# EAGLE design Main_backup (EAGLE 7.2.0)
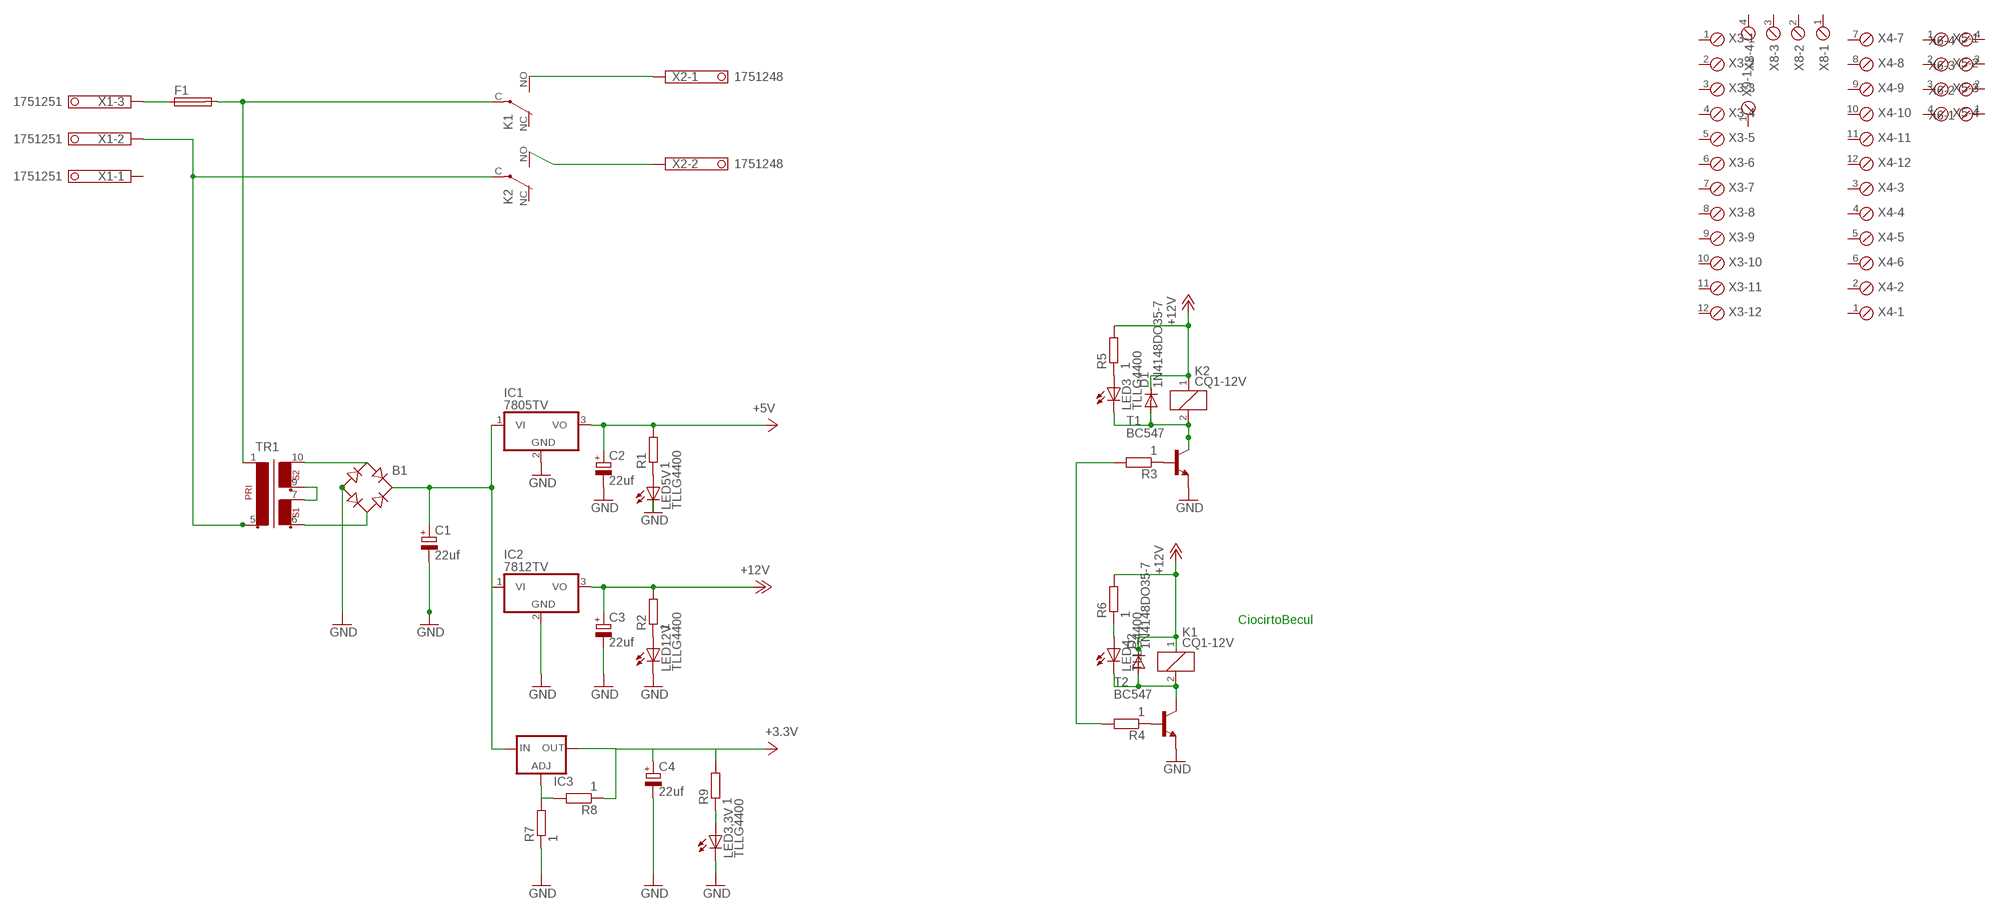
[diagram p0: schematic, sheet 1]

## Parts
B1  RB1A  [RB1A]
C1  22uf  CPOL-EUE2-4  [E2-4]
C2  22uf  CPOL-EUE2-4  [E2-4]
C3  22uf  CPOL-EUE2-4  [E2-4]
C4  22uf  CPOL-EUE2-4  [E2-4]
D1  1N4148DO35-7  [DO35-7]
D2  1N4148DO35-7  [DO35-7]
F1  SH25  [SH25]
IC1  7805TV  [TO220V]
IC2  7812TV  [TO220V]
IC3  LM317TS  [317TS]
K1  CQ1-12V  [CQ1]
K2  CQ1-12V  [CQ1]
LED3  TLLG4400  [LED3MM]
LED3,3V  TLLG4400  [LED3MM]
LED4  TLLG4400  [LED3MM]
LED5V  TLLG4400  [LED3MM]
LED12V  TLLG4400  [LED3MM]
R1  1  R-EU_0204/5  [0204/5]
R2  1  R-EU_0204/5  [0204/5]
R3  1  R-EU_0204/5  [0204/5]
R4  1  R-EU_0204/5  [0204/5]
R5  1  R-EU_0204/5  [0204/5]
R6  1  R-EU_0204/5  [0204/5]
R7  1  R-EU_0204/5  [0204/5]
R8  1  R-EU_0204/5  [0204/5]
R9  1  R-EU_0204/5  [0204/5]
T1  BC547  [TO92]
T2  BC547  [TO92]
TR1  EI30-2  [EI30-2]
X1  1751251  [1751251]
X2  1751248  [1751248]
X3  MPT12  [12POL254]
X4  MPT12  [12POL254]
X5  MPT4  [4POL254]
X6  MPT4  [4POL254]
X8  MPT4  [4POL254]
X9  MPT2  [2POL254]

## Nets
+3.3V: C4.+ IC3.2(OUT) R8.1 R9.2
+5V: C2.+ IC1.3(VO) R1.2
+12V: C3.+ D1.C D2.C IC2.3(VO) K1.1 K2.1 R2.2 R5.2 R6.2
GND: B1.- C1.- C2.- C3.- C4.- IC1.2(GND) IC2.2(GND) LED3,3V.K(C) LED5V.K(C) LED12V.K(C) R7.1 T1.1(E) T2.1(E)
N$1: F1.2 K1.C(2:P) TR1.1
N$2: K2.C(2:P) TR1.5 X1.2
N$3: K1.NO(2:S) X2.1
N$4: K2.NO(2:S) X2.2
N$5: TR1.7 TR1.9
N$6: B1.AC1 TR1.10
N$7: B1.AC2 TR1.6
N$8: B1.+ C1.+ IC1.1(VI) IC2.1(VI) IC3.3(IN)
N$9: D1.A K2.2 LED3.K(C) T1.3(C)
N$10: LED12V.A R2.1
N$11: LED3.A R5.1
N$12: D2.A K1.2 LED4.K(C) T2.3(C)
N$13: LED5V.A R1.1
N$14: R3.1 T1.2(B)
N$15: R4.1 T2.2(B)
N$16: R3.2 R4.2
N$17: F1.1 X1.3
N$18: LED4.A R6.1
N$19: IC3.1(ADJ) R7.2 R8.2
N$20: LED3,3V.A R9.1
Unconnected: K1.NC(2:O) K2.NC(2:O) X1.1 X3.1 X3.2 X3.3 X3.4 X3.5 X3.6 X3.7 X3.8 X3.9 X3.10 X3.11 X3.12 X4.1 X4.2 X4.3 X4.4 X4.5 X4.6 X4.7 X4.8 X4.9 X4.10 X4.11 X4.12 X5.1 X5.2 X5.3 X5.4 X6.1 X6.2 X6.3 X6.4 X8.1 X8.2 X8.3 X8.4 X9.1 X9.2

## Notes on the sheet
- CiocirtoBecul

## Library data of the parts
B1 = rectifier:RB1A: RECTIFIER 1 A
C1-C4 = rcl:CPOL-EU: POLARIZED CAPACITOR, European symbol
D1 D2 = diode:1N4148: DIODE high speed (Philips)
F1 = fuse:SH25: FUSE HOLDER grid 25 mm, OGN0031 8211, Schurter (Buerklin); MF: SCHURTER; MPN: 0031.8211; OC_FARNELL: 1162741; OC_NEWARK: 96B9380
IC1 IC2 = linear:78*: Positive VOLTAGE REGULATOR Source: http://cache.national.com/ds/LM/LM78L05.pdf http://www.fairchildsemi.com/ds/LM/LM7805.pdf
IC3 = v-reg:LM317TS: VOLTAGE REGULATOR
K1 K2 = relay:CQ1-12V: AUTOMOTIVE QUIET RELAY NAiS Source: http://www.mew-europe.com/.. en_ds_61208_0000.pdf; OC_FARNELL: unknown; OC_NEWARK: unknown
LED3 LED3,3V LED4 LED5V LED12V = led:TLLG4400: Low Current (2mA) LED 3 mm Tinted Diffused Package color GREEN Source: Data sheet <http://www.farnell.com/datasheets/391098.pdf>; MF: VISHAY SEMICONDUCTOR; OC_FARNELL: 1612435
R1-R9 = rcl:R-EU_: RESISTOR, European symbol
T1 T2 = transistor:BC547: NPN TRANSISTOR
TR1 = trafo:EI30-2: TRANSFORMER 1 primary winding, 2 secondary windings ERA
X1 = con-phoenix-350:1751251: MKDS 1/ 3-3,5 Printklemme Nennstrom: 10 A Bemessungsspannung: 160 V Raster: 3,5 mm Polzahl: 3 Montageart: Löten Anschlussart: Schraubanschluss Anschlussrichtung vom Leiter zur Platine: 0° Source: http://eshop.phoenixcontact.com .. 1751251.pdf; OC_FARNELL: unknown; OC_NEWARK: unknown
X2 = con-phoenix-350:1751248: MKDS 1/ 2-3,5 Printklemme Nennstrom: 10 A Bemessungsspannung: 160 V Raster: 3,5 mm Polzahl: 2 Montageart: Löten Anschlussart: Schraubanschluss Anschlussrichtung vom Leiter zur Platine: 0° Source: http://eshop.phoenixcontact.com .. 1751248.pdf; OC_FARNELL: unknown; OC_NEWARK: unknown
X3 X4 = con-phoenix-254:MPT12: PHOENIX CONNECTOR; OC_FARNELL: unknown; OC_NEWARK: unknown
X5 X6 X8 = con-phoenix-254:MPT4: PHOENIX CONNECTOR; OC_FARNELL: unknown; OC_NEWARK: unknown
X9 = con-phoenix-254:MPT2: PHOENIX CONNECTOR; OC_FARNELL: unknown; OC_NEWARK: unknown

## Net classes
0 default: width 0.61 mm

## Board
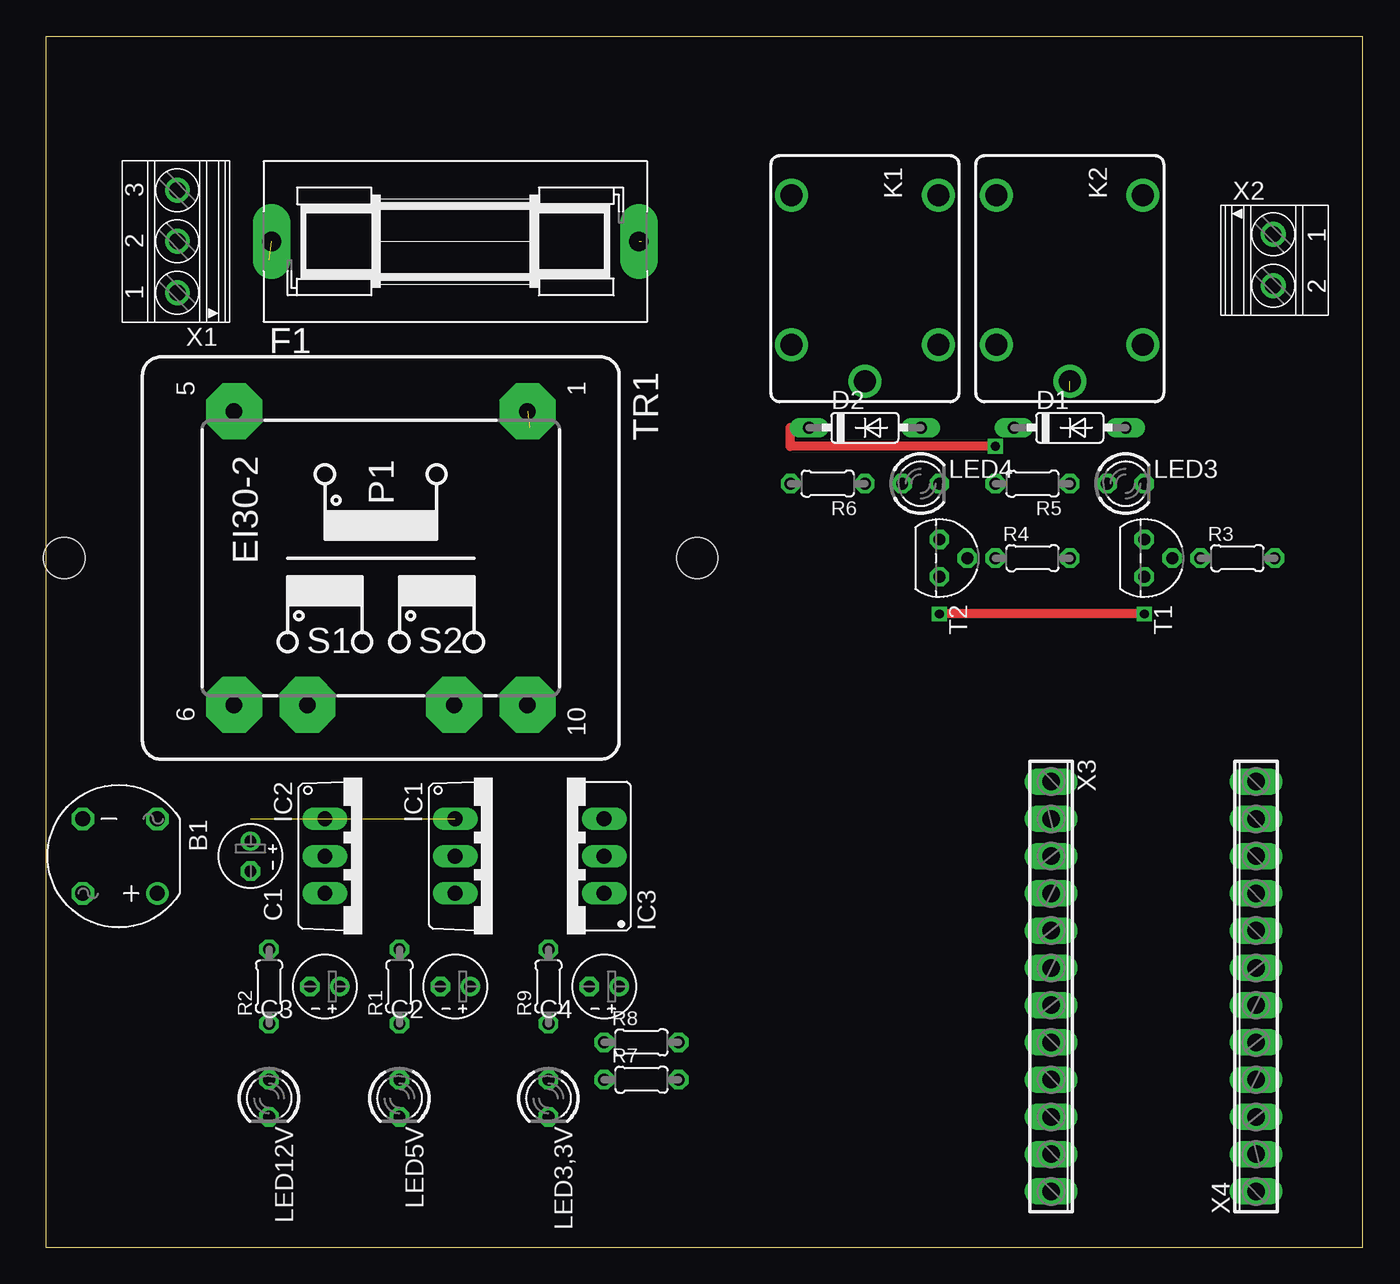
[diagram p1: board, top side]
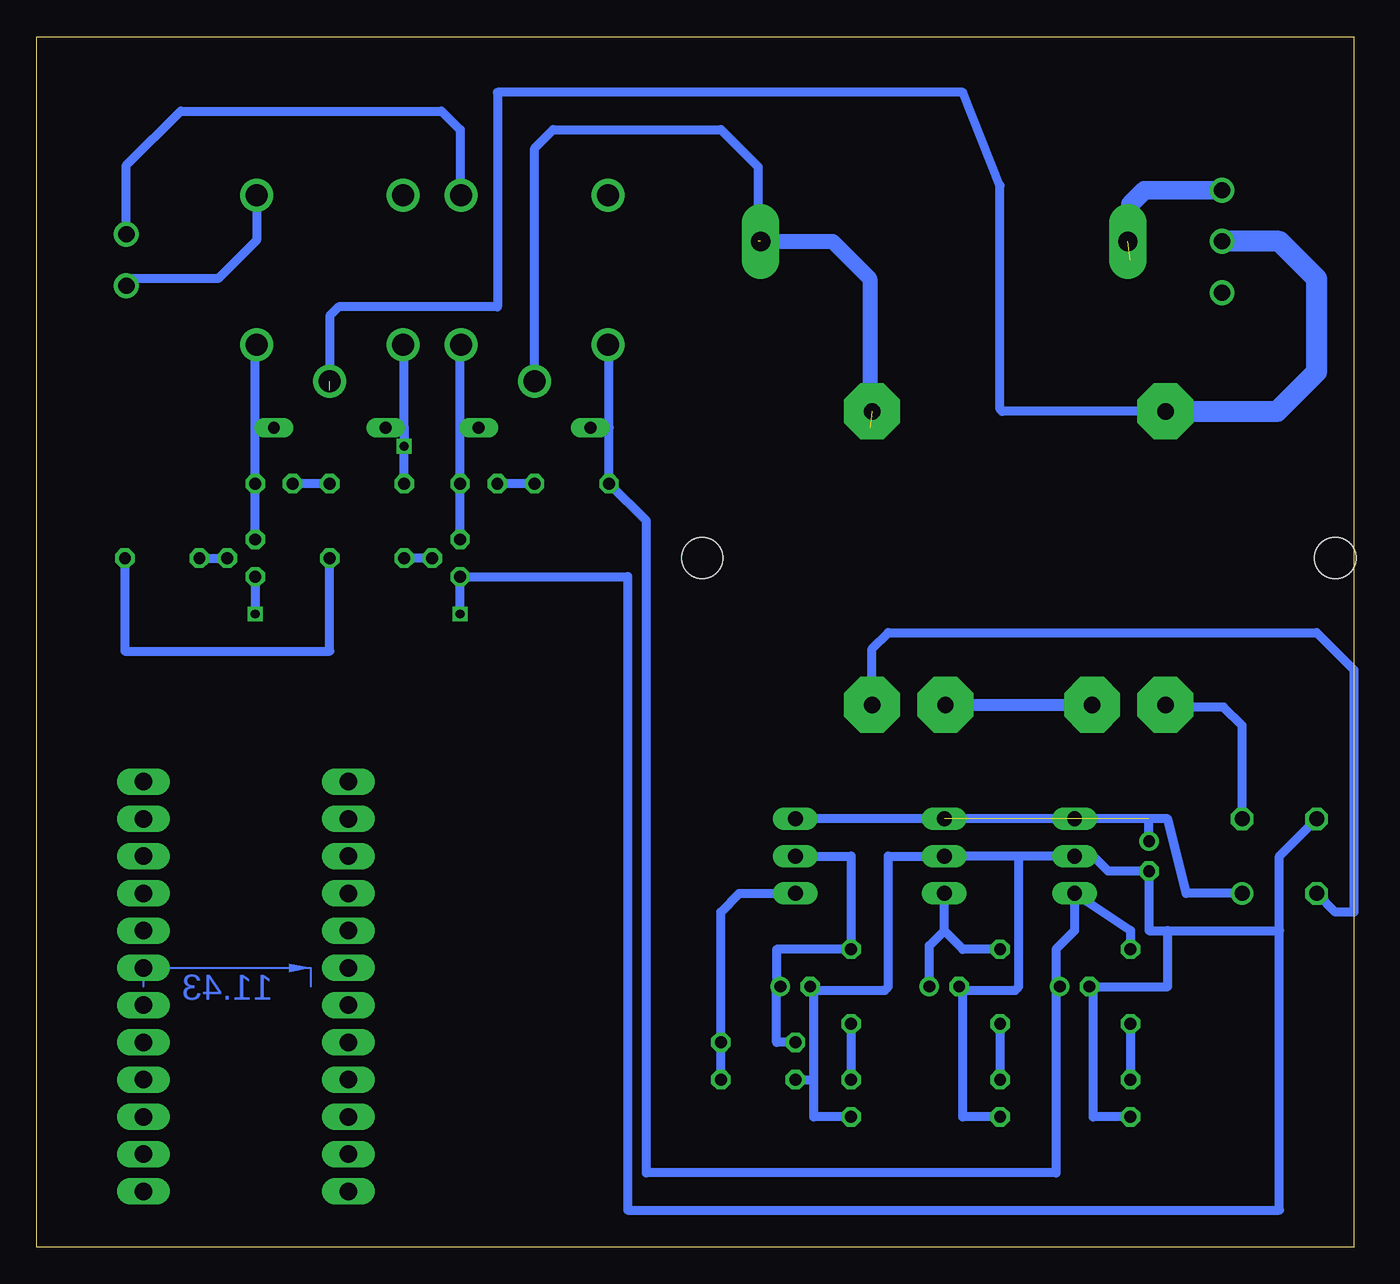
[diagram p2: board, bottom side, seen from below]

Size 89.84 x 82.54 mm. Coordinates in mm from the lower left corner, seen from the top.
Outline: 0,0 89.84,0 89.84,82.54 0,82.54 0,0
Copper layers (1*16): Top 0.035mm / dielectric 1.5mm / Bottom 0.035mm
Design rules "default": minimum track width 10mil, minimum drill 24mil, track to track 8mil, track to pad 8mil, pad to pad 8mil, via to via 8mil, smd to smd 8mil, copper to edge 40mil, drill to drill 8mil, minimum pad ring 10mil, minimum via ring 8mil, stop-mask expansion 4mil, vias tented up to drill 0mil, thermal gap 10mil
Holes 2.8 mm at 1.27,46.99 44.45,46.99

### Footprints (pad centres in the part's own frame; a part is rotated, then mirrored left to right if it is on the bottom)
RB1A = drill 1.016: + -2.54,2.54 | drill 1.016 octagon: - 2.54,-2.54; AC1 2.54,2.54; AC2 -2.54,-2.54
E2-4 = drill 0.813 pad 1.27: + -1.016,0 | drill 0.813 pad 1.27 octagon: - 1.016,0
DO35-7 = drill 0.813 long: A 3.81,0; C -3.81,0
SH25 = drill 1.321 pad 2.54 long: 1 -12.522,0; 2 12.522,0
TO220V = drill 1.016 long: 1 -2.54,-2.54; 2 0,-2.54; 3 2.54,-2.54
317TS = drill 1.016 long: 1 -2.54,-2.54; 2 0,-2.54; 3 2.54,-2.54
CQ1 = drill 1.5: 1 4.5,-5; 2 4.5,5; C 7,0; NC -5.7,-5; NO -5.7,5
LED3MM = drill 0.813 octagon: A -1.27,0; K 1.27,0
0204/5 = drill 0.813 octagon: 1 -2.54,0; 2 2.54,0
TO92 = drill 0.813 octagon: 1 1.27,0; 2 0,1.905; 3 -1.27,0
EI30-2 = drill 1.118 pad 3.81 octagon: 1 -10.008,10.008; 5 -10.008,-10.008; 6 10.008,-10.008; 7 10.008,-5.004; 9 10.008,5.004; 10 10.008,10.008
1751251 = drill 1.1 pad 1.7: 1 -3.5,-0.1; 2 0,-0.1; 3 3.5,-0.1
1751248 = drill 1.1 pad 1.7: 1 -1.75,-0.1; 2 1.75,-0.1
12POL254 = drill 1.2 long: 1 -13.97,0; 2 -11.43,0; 3 -8.89,0; 4 -6.35,0; 5 -3.81,0; 6 -1.27,0; 7 1.27,0; 8 3.81,0; 9 6.35,0; 10 8.89,0; 11 11.43,0; 12 13.97,0
4POL254 = drill 1.2 long: 1 -3.81,0; 2 -1.27,0; 3 1.27,0; 4 3.81,0
2POL254 = drill 1.2 long: 1 -1.27,0; 2 1.27,0

### Placement (x,y rotation side)
B1  5.08,26.67 180 top
C1  13.97,26.67 270 top
C2  27.94,17.78 180 top
C3  19.05,17.78 180 top
C4  38.1,17.78 180 top
D1  69.85,55.88 0 top
D2  55.88,55.88 0 top
F1  27.94,68.58 0 top
IC1  30.48,26.67 270 top
IC2  21.59,26.67 270 top
IC3  35.56,26.67 90 top
K1  55.88,66.04 270 top
K2  69.85,66.04 270 top
LED3  73.66,52.07 0 top
LED3,3V  34.29,10.16 270 top
LED4  59.69,52.07 0 top
LED5V  24.13,10.16 270 top
LED12V  15.24,10.16 270 top
R1  24.13,17.78 90 top
R2  15.24,17.78 90 top
R3  81.28,46.99 0 top
R4  67.31,46.99 0 top
R5  67.31,52.07 180 top
R6  53.34,52.07 180 top
R7  40.64,11.43 0 top
R8  40.64,13.97 0 top
R9  34.29,17.78 90 top
T1  74.93,46.99 270 top
T2  60.96,46.99 270 top
TR1  22.86,46.99 270 top
X1  8.89,68.58 90 top
X2  83.82,67.31 270 top
X3  68.58,17.78 270 top
X4  82.55,17.78 90 top
X5  5.08,-87.63 0 top  (outside the outline)
X6  5.08,-93.98 0 top  (outside the outline)
X8  5.08,-74.93 0 top  (outside the outline)
X9  2.54,-81.28 0 top  (outside the outline)

### Tracks (layer width: path | path; a pad name or v marks a point on that pad's centre or on a via)
+3.3V
  Bottom 0.61: IC3.2 34.29,26.67 R9.2 39.37,20.32 39.37,18.03 C4.+ 39.37,17.53 39.37,13.97 R8.1
+5V
  Bottom 0.61: R1.2 26.67,20.32 27.94,21.59 | 27.94,21.59 IC1.3 | C2.+ 28.96,20.57 27.94,21.59
+12V  (via drill 0.61 pad 0.61)
  Top 0.61: v64.77,54.61 50.8,54.61 50.8,55.88 D2.C
  Bottom 0.61: R2.2 15.24,21.59 IC2.3 19.05,21.59 20.32,20.32 20.32,18.03 | 20.32,18.03 C3.+ | D2.C 50.8,55.88 | 50.8,55.88 50.8,61.46 K1.1 | D1.C 64.77,55.88 | 64.77,55.88 64.77,61.46 K2.1 | 50.8,55.88 R6.2 48.26,49.53 48.26,5.08 20.32,5.08 20.32,18.03 | R5.2 v64.77,54.61 64.77,55.88
GND  (via drill 0.61 pad 0.61)
  Top 0.61: v74.93,43.18 v60.96,43.18
  Bottom 0.61: 22.86,26.67 IC2.2 17.78,26.67 16.76,25.65 C1.- 13.97,21.59 12.7,21.59 | 22.86,26.67 IC1.2 31.75,26.67 31.75,17.78 32,17.53 37.08,17.53 | 12.7,21.59 5.08,21.59 | 5.08,21.59 5.08,26.67 B1.- | LED12V.K 17.78,8.89 17.78,17.53 | 17.78,17.53 C3.- 17.78,17.78 | LED5V.K 26.67,8.89 26.67,17.53 | 26.67,17.53 C2.- | LED3,3V.K 36.83,8.89 36.83,11.43 | 36.83,11.43 36.83,17.53 C4.- 37.08,17.53 | 37.08,17.53 36.83,17.78 | 17.78,17.78 17.78,17.53 | 17.78,17.78 12.7,17.78 12.7,21.59 | 26.67,17.53 23.11,17.53 22.86,17.78 22.86,26.67 | R7.1 36.83,11.43 | 5.08,21.59 5.08,2.54 49.53,2.54 49.53,45.72 T2.1 v60.96,43.18 | T1.1 v74.93,43.18
N$1  (2 unrouted)
  Bottom 0.61: K1.C 55.88,74.93 54.61,76.2 43.18,76.2 40.64,73.66 40.64,68.58
  Bottom 1.006: F1.2 35.56,68.58 33.02,66.04 33.02,55.88
N$2  (1 unrouted)
  Bottom 0.61: TR1.5 23.98,57 24.13,57.15 24.13,72.39 26.67,78.74 58.42,78.74 58.42,64.12 69.23,64.12 69.85,63.5 69.85,58.42
  Bottom 1.422: TR1.5 5.23,57 2.54,59.69 2.54,66.04 5.08,68.58 X1.2
N$3
  Bottom 0.61: X2.1 83.72,73.76 80.01,77.47 62.23,77.47 60.96,76.2 60.96,71.82 K1.NO
N$4
  Bottom 0.61: K2.NO 74.85,68.66 77.47,66.04 83.24,66.04 X2.2
N$5
  Bottom 0.813: TR1.9 TR1.7
N$6
  Bottom 0.61: TR1.10 32.87,40.79 31.75,41.91 2.54,41.91 0,39.37 0,22.86 1.27,22.86 B1.AC1
N$7
  Bottom 0.61: B1.AC2 7.62,35.56 8.89,36.83 12.7,36.83 TR1.6
N$8  (2 unrouted)
  Bottom 0.61: B1.+ 11.43,24.13 12.7,29.21 13.97,29.21 | 13.97,29.21 IC3.3 | C1.+ 13.97,29.21
N$9
  Bottom 0.61: D1.A 74.93,55.88 | 74.93,55.88 74.93,61.46 K2.2 | 74.93,55.88 LED3.K T1.3
N$10
  Bottom 0.61: R2.1 LED12V.A
N$11
  Bottom 0.61: R5.1 LED3.A
N$12
  Bottom 0.61: D2.A 60.96,55.88 | 60.96,55.88 60.96,61.46 K1.2 | 60.96,55.88 LED4.K T2.3
N$13
  Bottom 0.61: R1.1 LED5V.A
N$14
  Bottom 0.61: R3.1 T1.2
N$15
  Bottom 0.61: T2.2 R4.1
N$16
  Bottom 0.61: R3.2 83.82,40.64 69.85,40.64 R4.2
N$17  (1 unrouted)
  Bottom 1.27: X1.3 14.28,72.08 15.24,71.12 15.24,67.31
N$18
  Bottom 0.61: R6.1 LED4.A
N$19
  Bottom 0.61: R7.2 R8.2 43.18,22.86 41.91,24.13 IC3.1
N$20
  Bottom 0.61: R9.1 LED3,3V.A
(copper drawn outside any net)
  shapes: Bottom area x1